# EAGLE design board1 (EAGLE 9.6.2)
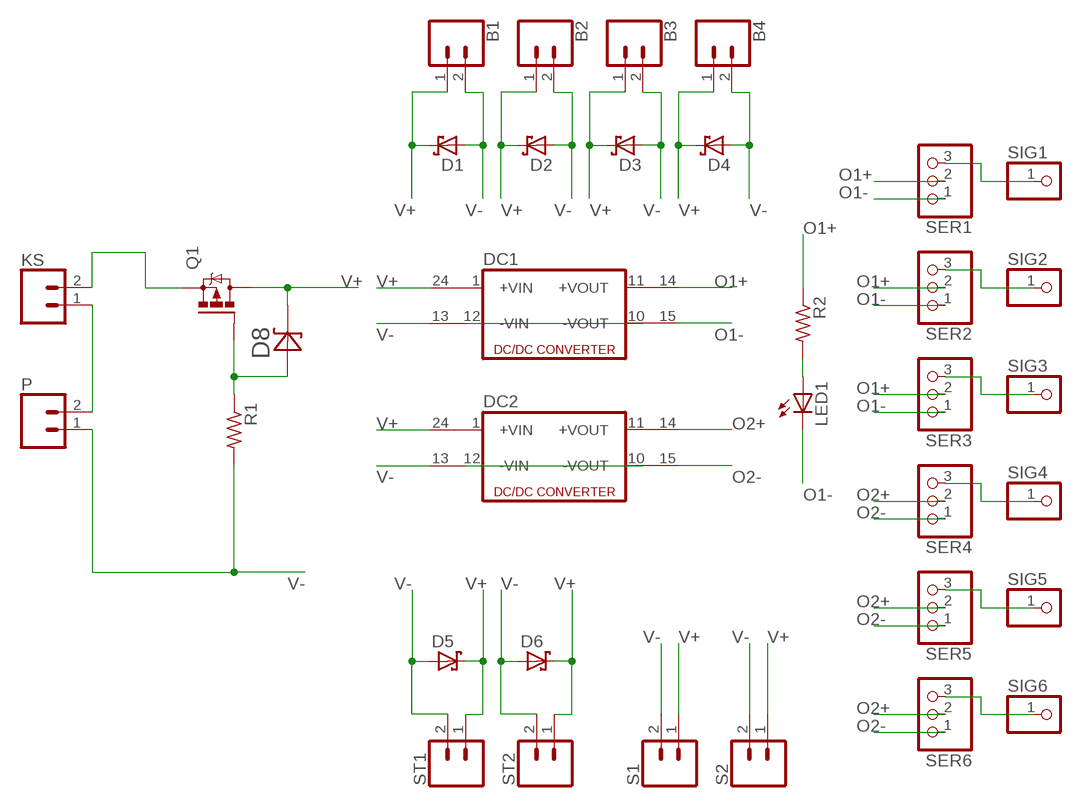
[diagram p0: schematic, sheet 1]

## Parts
B1  CONN_02  [1X02]
B2  CONN_02  [1X02]
B3  CONN_02  [1X02]
B4  CONN_02  [1X02]
D1  SCHOTTKY-DIODEAG  [AG]
D2  SCHOTTKY-DIODEAG  [AG]
D3  SCHOTTKY-DIODEAG  [AG]
D4  SCHOTTKY-DIODEAG  [AG]
D5  SCHOTTKY-DIODEAG  [AG]
D6  SCHOTTKY-DIODEAG  [AG]
D8  1N4752A-T  [DIOAD1060W80L410D260]
DC1  DC213R  [CMK]
DC2  DC213R  [CMK]
KS  CONN_02  [1X02]
LED1  LED5MM  [LED5MM]
P  CONN_02  [1X02]
Q1  IRF9530  [TO220BV]
R1  R-US_0207/10  [0207/10]
R2  R-US_0207/10  [0207/10]
S1  CONN_02  [1X02]
S2  CONN_02  [1X02]
SER1  PINHD-1X3  [1X03]
SER2  PINHD-1X3  [1X03]
SER3  PINHD-1X3  [1X03]
SER4  PINHD-1X3  [1X03]
SER5  PINHD-1X3  [1X03]
SER6  PINHD-1X3  [1X03]
SIG1  PINHD-1X1  [1X01]
SIG2  PINHD-1X1  [1X01]
SIG3  PINHD-1X1  [1X01]
SIG4  PINHD-1X1  [1X01]
SIG5  PINHD-1X1  [1X01]
SIG6  PINHD-1X1  [1X01]
ST1  CONN_02  [1X02]
ST2  CONN_02  [1X02]

## Nets
N$1: KS.1 P.2
N$3: D8.A Q1.G R1.1
N$4: KS.2 Q1.S
N$16: LED1.A R2.2
N$18: DC1.10(-VOUT) DC1.12(-VIN)
N$19: DC2.10(-VOUT) DC2.12(-VIN)
N$32: SER1.3 SIG1.1
N$33: SER2.3 SIG2.1
N$34: SER3.3 SIG3.1
N$35: SER4.3 SIG4.1
N$36: SER5.3 SIG5.1
N$37: SER6.3 SIG6.1
O1+: DC1.14(+VOUT1) R2.1 SER1.2 SER2.2 SER3.2
O1-: DC1.15(-VOUT1) LED1.K(C) SER1.1 SER2.1 SER3.1
O2+: DC2.14(+VOUT1) SER4.2 SER5.2 SER6.2
O2-: DC2.15(-VOUT1) SER4.1 SER5.1 SER6.1
V+: B1.1 B2.1 B3.1 B4.1 D1.C D2.C D3.C D4.C D5.C D6.C D8.C DC1.24(+VIN1) DC2.24(+VIN1) Q1.D S1.1 S2.1 ST1.1 ST2.1
V-: B1.2 B2.2 B3.2 B4.2 D1.A D2.A D3.A D4.A D5.A D6.A DC1.13(-VIN1) DC2.13(-VIN1) P.1 R1.2 S1.2 S2.2 ST1.2 ST2.2
Unconnected: DC1.1(+VIN) DC1.11(+VOUT) DC2.1(+VIN) DC2.11(+VOUT)

## Library data of the parts
B1-B4 KS P S1 S2 ST1 ST2 = SparkFun-Connectors:CONN_02: Multi connection point. Often used as Generic Header-pin footprint for 0.1 inch spaced/style header connections On any of the 0.1 inch spaced packages, you can populate with these: Break Away Headers - Straight <https://www.sparkfun.com/products/116> (PRT-00116) Break Away Male Headers - Right Angle <https://www.sparkfun.com/products/553> (PRT-00553) Female Headers <https://www.sparkfun.com/products/115> (PRT-00115) Break Away Headers - Machine Pin <https://www.sparkfun.com/products/117> (PRT-00117) Break Away Female Headers - Swiss Machine Pin <https://www.sparkfun.com/products/743> (PRT-00743) For SCREWTERMINALS and SPRING TERMINALS visit here: Screw Terimnals on SparkFun.com <https://www.sparkfun.com/search/results?term=Screw+Terminals> (5mm/3.5mm/2.54mm spacing) This device is also useful as a general connection point to wire up your design to another part of your project. Our various solder wires solder well into these plated through hole pads. Hook-Up Wire - Assortment (Stranded, 22 AWG) <https://www.sparkfun.com/products/11375> (PRT-11375) Hook-Up Wire - Assortment (Solid Core, 22 AWG) <https://www.sparkfun.com/products/11367> (PRT-11367) View the entire wire category on our website here <https://www.sparkfun.com/categories/141> Special notes: Molex polarized connector foot print use with: PRT-08233 with associated crimp pins and housings. 2.54_SCREWTERM for use with PRT-10571. 3.5mm Screw Terminal footprints for PRT-08084 5mm Screw Terminal footprints for use with PRT-08432
D1-D6 = adafruit:SCHOTTKY-DIODE: Schottky Diode
D8 = 1N4752A-T:1N4752A-T: DIODE ZENER 33V 1W DO41 Check prices <https://pricing.snapeda.com/parts/1N4752A/ON%20Semiconductor/view-part?ref=eda>; AVAILABILITY: In Stock; DESCRIPTION: Zener Diode 33 V 1 W ±5% Through Hole DO-41; MF: ON Semiconductor; MP: 1N4752A; PACKAGE: DO-41-2 ON Semiconductor; PRICE: None; PURCHASE-URL: https://pricing.snapeda.com/search/part/1N4752A/?ref=eda
DC1 DC2 = dc-dc-converter:DC213R: DC-DC CONVERTER; OC_FARNELL: unknown; OC_NEWARK: unknown
LED1 = adafruit:LED: LED OSRAM: - CHIPLED LG R971, LG N971, LY N971, LG Q971, LY Q971, LO R971, LY R971 LH N974, LH R974 LS Q976, LO Q976, LY Q976 LO Q996 - Hyper CHIPLED LW Q18S LB Q993, LB Q99A, LB R99A - SideLED LS A670, LO A670, LY A670, LG A670, LP A670 LB A673, LV A673, LT A673, LW A673 LH A674 LY A675 LS A676, LA A676, LO A676, LY A676, LW A676 LS A679, LY A679, LG A679 - Hyper Micro SIDELED® LS Y876, LA Y876, LO Y876, LY Y876 LT Y87S - SmartLED LW L88C, LW L88S LB L89C, LB L89S, LG L890 LS L89K, LO L89K, LY L89K LS L896, LA L896, LO L896, LY L896 - TOPLED LS T670, LO T670, LY T670, LG T670, LP T670 LSG T670, LSP T670, LSY T670, LOP T670, LYG T670 LG T671, LOG T671, LSG T671 LB T673, LV T673, LT T673, LW T673 LH T674 LS T676, LA T676, LO T676, LY T676, LB T676, LH T676, LSB T676, LW T676 LB T67C, LV T67C, LT T67C, LS T67K, LO T67K, LY T67K, LW E67C LS E67B, LA E67B, LO E67B, LY E67B, LB E67C, LV E67C, LT E67C LW T67C LS T679, LY T679, LG T679 LS T770, LO T770, LY T770, LG T770, LP T770 LB T773, LV T773, LT T773, LW T773 LH T774 LS E675, LA E675, LY E675, LS T675 LS T776, LA T776, LO T776, LY T776, LB T776 LHGB T686 LT T68C, LB T68C - Hyper Mini TOPLED® LB M676 - Mini TOPLED Santana® LG M470 LS M47K, LO M47K, LY M47K Source: http://www.osram.convergy.de/
Q1 = transistor-power:IRF9530: P-CHANNEL HEXFET POWER-MOS-FET Source: http://www.irf.com/product-info/datasheets/data/irf9530.pdf
R1 R2 = rcl:R-US_: RESISTOR, American symbol; SPICEPREFIX: R
SER1-SER6 = pinhead:PINHD-1X3: PIN HEADER
SIG1-SIG6 = pinhead:PINHD-1X1: PIN HEADER

## Board
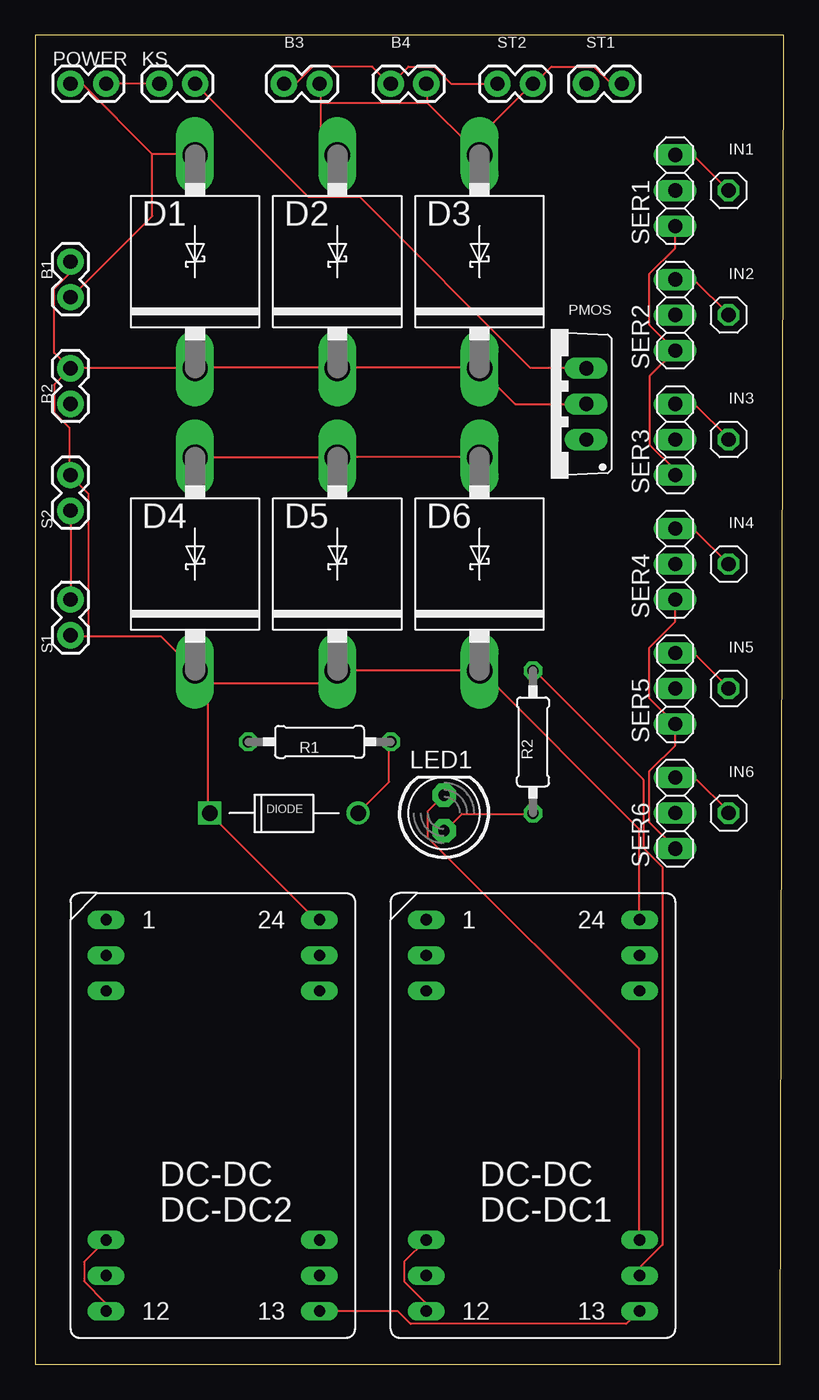
[diagram p1: board, top side]
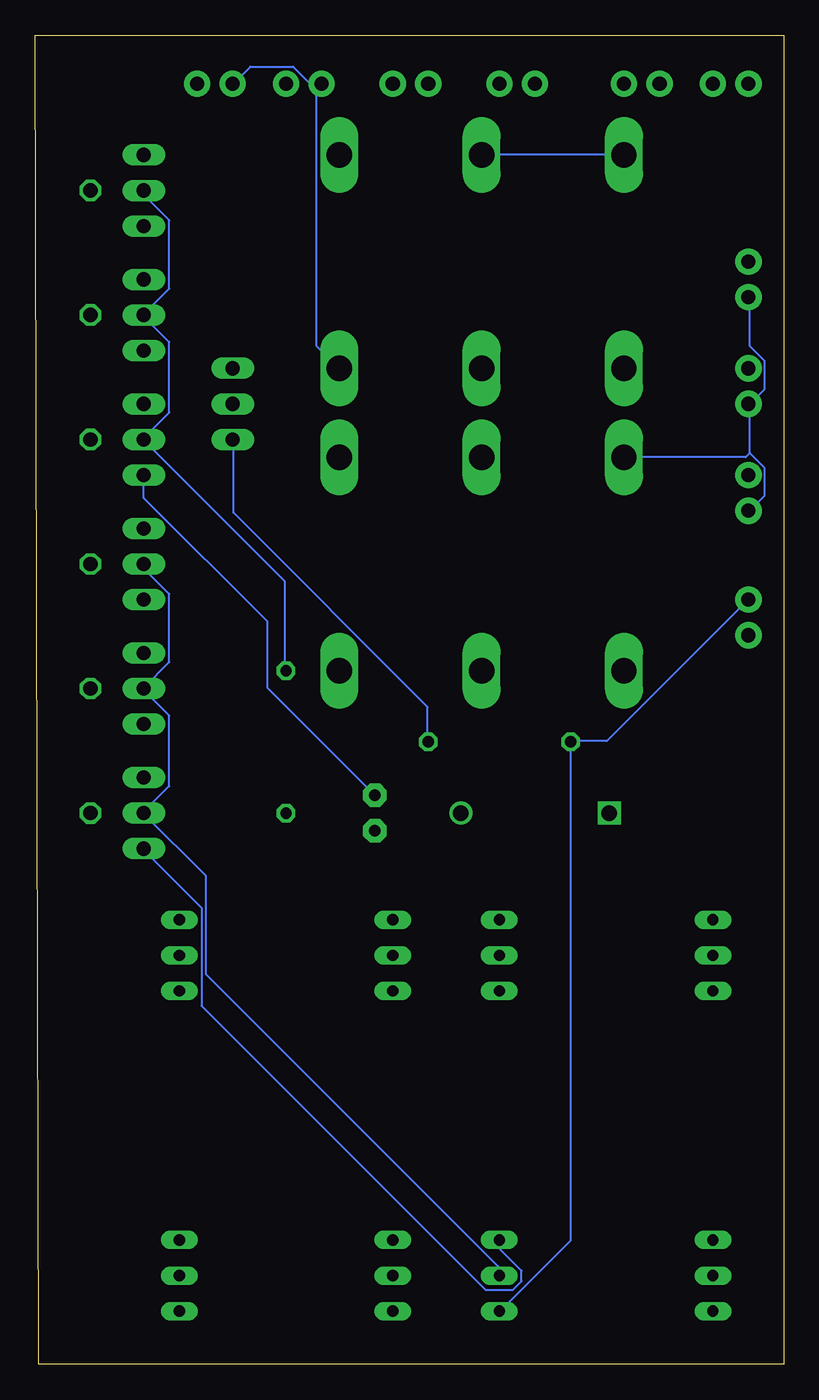
[diagram p2: board, bottom side, seen from below]

Size 53.49 x 94.92 mm. Coordinates in mm from the lower left corner, seen from the top.
Outline: 0,0 53.23,0 53.49,94.92 0,94.92 0,0
Copper layers (1*16): Top 0.035mm / dielectric 1.5mm / Bottom 0.035mm
Design rules "default": minimum track width 6mil, minimum drill 0.35mm, track to track 6mil, track to pad 6mil, pad to pad 6mil, via to via 6mil, smd to smd 6mil, copper to edge 40mil, drill to drill 6mil, minimum pad ring 10mil, minimum via ring 8mil, stop-mask expansion 4mil, vias tented up to drill 0mil, thermal gap 10mil

### Footprints (pad centres in the part's own frame; a part is rotated, then mirrored left to right if it is on the bottom)
1X02 = drill 1.016 pad 1.88: 1 0,0; 2 2.54,0
AG = drill 1.803 long: A 7.62,0; C -7.62,0
DIOAD1060W80L410D260 = drill 1.1 pad 1.65: A 5.3,0 | drill 1.1 pad 1.65 square: C -5.3,0
CMK = drill 0.813 long: 1 -7.62,13.97; 2 -7.62,11.43; 3 -7.62,8.89; 10 -7.62,-8.89; 11 -7.62,-11.43; 12 -7.62,-13.97; 13 7.62,-13.97; 14 7.62,-11.43; 15 7.62,-8.89; 22 7.62,8.89; 23 7.62,11.43; 24 7.62,13.97
LED5MM = drill 0.813 pad 1.676 octagon: A -1.27,0; K 1.27,0
TO220BV = drill 1.016 long: D 0,-2.54; G -2.54,-2.54; S 2.54,-2.54
0207/10 = drill 0.813 octagon: 1 -5.08,0; 2 5.08,0
1X03 = drill 1.016 long: 1 -2.54,0; 2 0,0; 3 2.54,0
1X01 = drill 1.016 octagon: 1 0,0

### Placement (x,y rotation side)
B1  2.54,78.74 270 top
B2  2.54,71.12 270 top
B3  17.78,91.44 0 top
B4  25.4,91.44 0 top
D1  11.43,78.74 90 top
D2  21.59,78.74 90 top
D3  31.75,78.74 90 top
D4  11.43,57.15 90 top
D5  21.59,57.15 90 top
D6  31.75,57.15 90 top
D8  17.78,39.37 0 top
DC1  35.56,17.78 0 top
DC2  12.7,17.78 0 top
KS  8.89,91.44 0 top
LED1  29.21,39.37 90 top
P  2.54,91.44 0 top
Q1  36.83,68.58 90 top
R1  20.32,44.45 180 top
R2  35.56,44.45 270 top
S1  2.54,52.07 90 top
S2  2.54,63.5 270 top
SER1  45.72,83.82 90 top
SER2  45.72,74.93 90 top
SER3  45.72,66.04 90 top
SER4  45.72,57.15 90 top
SER5  45.72,48.26 90 top
SER6  45.72,39.37 90 top
SIG1  49.53,83.82 0 top
SIG2  49.53,74.93 0 top
SIG3  49.53,66.04 0 top
SIG4  49.53,57.15 0 top
SIG5  49.53,48.26 0 top
SIG6  49.53,39.37 0 top
ST1  39.37,91.44 0 top
ST2  33.02,91.44 0 top

### Tracks (layer width: path | path; a pad name or v marks a point on that pad's centre or on a via)
N$1
  Top 0.152: KS.1 P.2
N$3
  Top 0.152: R1.1 25.3,44.35 25.3,41.6 23.16,39.47 D8.A
  Bottom 0.152: Q1.G 39.32,65.99 39.32,60.81 25.45,46.94 25.45,44.5 R1.1
N$4
  Top 0.152: KS.2 19.51,83.36 23.16,83.36 35.36,71.17 39.32,71.17 Q1.S
N$16
  Top 0.152: R2.2 35.51,39.32 30.48,39.32 29.26,38.1 LED1.A
N$18
  Top 0.152: DC1.10 26.36,7.32 26.36,5.94 27.89,4.42 27.89,3.81 DC1.12
N$19
  Top 0.152: DC2.10 3.5,7.32 3.5,5.94 5.03,4.42 5.03,3.81 DC2.12
N$32
  Top 0.152: SIG1.1 47.09,86.26 45.72,86.26 SER1.3
N$33
  Top 0.152: SER2.3 45.72,77.42 47.09,77.42 49.53,74.98 SIG2.1
N$34
  Top 0.152: SER3.3 47.09,68.58 49.53,66.14 SIG3.1
N$35
  Top 0.152: SIG4.1 47.09,59.59 45.72,59.59 SER4.3
N$36
  Top 0.152: SER5.3 45.72,50.75 47.09,50.75 49.53,48.31 SIG5.1
N$37
  Top 0.152: SER6.3 47.09,41.91 49.53,39.47 SIG6.1
O1+
  Top 0.152: DC1.14 43.28,6.4 43.28,7.01 44.81,8.53 44.81,35.51 43.43,36.88 43.43,41.76 35.66,49.53 R2.1
  Bottom 0.152: R2.1 35.66,49.53 35.66,55.93 45.72,65.99 SER3.2 45.72,66.14 43.89,67.97 43.89,73 45.72,74.83 SER2.2 45.72,74.98 43.89,76.81 43.89,81.69 45.72,83.52 SER1.2
O1-
  Top 0.152: SER3.1 45.72,63.86 43.89,65.68 43.89,70.56 SER2.1 43.89,74.22 43.89,77.88 45.72,79.7 SER1.1 | LED1.K 28.04,39.47 28.04,37.64 43.13,22.55 43.13,8.99 DC1.15
  Bottom 0.152: SER3.1 45.72,61.87 36.88,53.03 36.88,48.31 LED1.K
O2+
  Bottom 0.152: DC2.14 20.42,6.4 20.42,7.01 41.3,27.89 41.3,34.9 45.72,39.32 SER6.2 45.72,39.47 43.89,41.3 43.89,46.33 45.72,48.16 SER5.2 45.72,48.31 43.89,50.14 43.89,55.02 45.72,56.84 SER4.2
O2-
  Top 0.152: SER6.1 45.72,36.88 43.89,38.71 43.89,42.37 45.72,44.2 SER5.1 43.89,47.55 43.89,51.21 45.72,53.03 SER4.1
  Bottom 0.152: DC2.15 20.27,8.84 20.27,8.23 18.75,6.71 18.75,5.94 19.36,5.33 21.34,5.33 41.6,25.6 41.6,32.61 45.72,36.73 SER6.1
V+
  Top 0.152: DC2.24 20.27,31.85 19.96,31.85 12.5,39.32 D8.C 12.34,39.47 12.34,48.62 | 3.81,51.97 8.99,51.97 D4.C 12.34,48.62 | 3.81,51.97 2.59,51.97 S1.1 | DC1.24 43.13,31.85 43.13,38.25 31.85,49.53 D6.C D5.C 21.49,49.53 20.57,48.62 12.34,48.62 | B2.1 1.37,69.95 1.37,67.97 2.44,66.9 2.44,63.55 S2.1 2.59,63.4 3.81,62.18 3.81,51.97 | B1.1 2.44,78.64 2.44,77.88 1.37,76.81 1.37,72.24 2.44,71.17 B2.1 | 11.43,71.17 2.59,71.17 B2.1 | B3.1 18.59,91.44 19.81,92.66 24.08,92.66 25.3,91.44 B4.1 25.45,91.44 26.67,92.66 28.5,92.66 29.72,91.44 ST2.1 | Q1.D 34.29,68.58 D3.C 31.7,71.17 21.64,71.17 D2.C 21.49,71.17 11.43,71.17 | 11.43,71.17 D1.C
  Bottom 0.152: 33.38,91.44 33.83,91.44 35.05,92.66 38.1,92.66 39.32,91.44 ST1.1 | 33.38,91.44 ST2.1 33.07,91.44 | 33.38,91.44 33.38,72.69 31.85,71.17 D3.C
V-
  Top 0.152: P.1 3.35,91.44 8.38,86.41 | 8.38,86.41 11.43,86.41 D1.A | 20.42,90.07 20.42,87.48 21.49,86.41 D2.A | 20.42,90.07 20.42,91.44 B3.2 | 28.04,90.07 28.04,91.44 B4.2 | 31.09,87.02 D3.A 31.7,86.41 | 31.09,87.02 28.04,90.07 | 31.09,87.02 35.51,91.44 ST2.2 35.66,91.44 36.88,92.66 39.93,92.66 41.15,91.44 ST1.2 | 28.04,90.07 20.42,90.07 | DC2.13 25.91,3.81 26.82,2.9 42.22,2.9 43.13,3.81 DC1.13 | D6.A D5.A D4.A | S2.2 2.59,60.96 2.59,54.71 S1.2 | 8.38,86.41 8.38,81.99 2.59,76.2 B1.2
  Bottom 0.152: D1.A 11.43,86.41 21.49,86.41 D2.A | S1.2 12.65,44.5 15.24,44.5 R1.2 15.24,8.84 20.27,3.81 DC2.13 | 2.44,65.08 2.44,68.58 | 2.44,65.08 1.37,64.01 1.37,62.03 2.44,60.96 S2.2 | 2.44,68.58 1.37,69.65 1.37,71.63 2.44,72.69 2.44,76.2 B1.2 | 2.44,68.58 B2.2 | D4.A 2.74,64.77 2.44,65.08

### Text on the board
tNames: B3 | B4 | ST2 | ST1 | POWER | KS | IN1 | D1 | D2 | D3 | B1 | IN2 | PMOS | B2 | IN3 | S2 | D4 | D5 | D6 | IN4 | S1 | IN5 | R1 | R2 | IN6 | DIODE | DC-DC2 | DC-DC1